# Altium schematic sheet stm_btn.SchDoc
size 420 x 297 mm; Organization: Altium Limited; Address1: L3, 12a Rodborough Rd; Address2: Frenchs Forest; Address3: NSW; Address4: Australia 2086
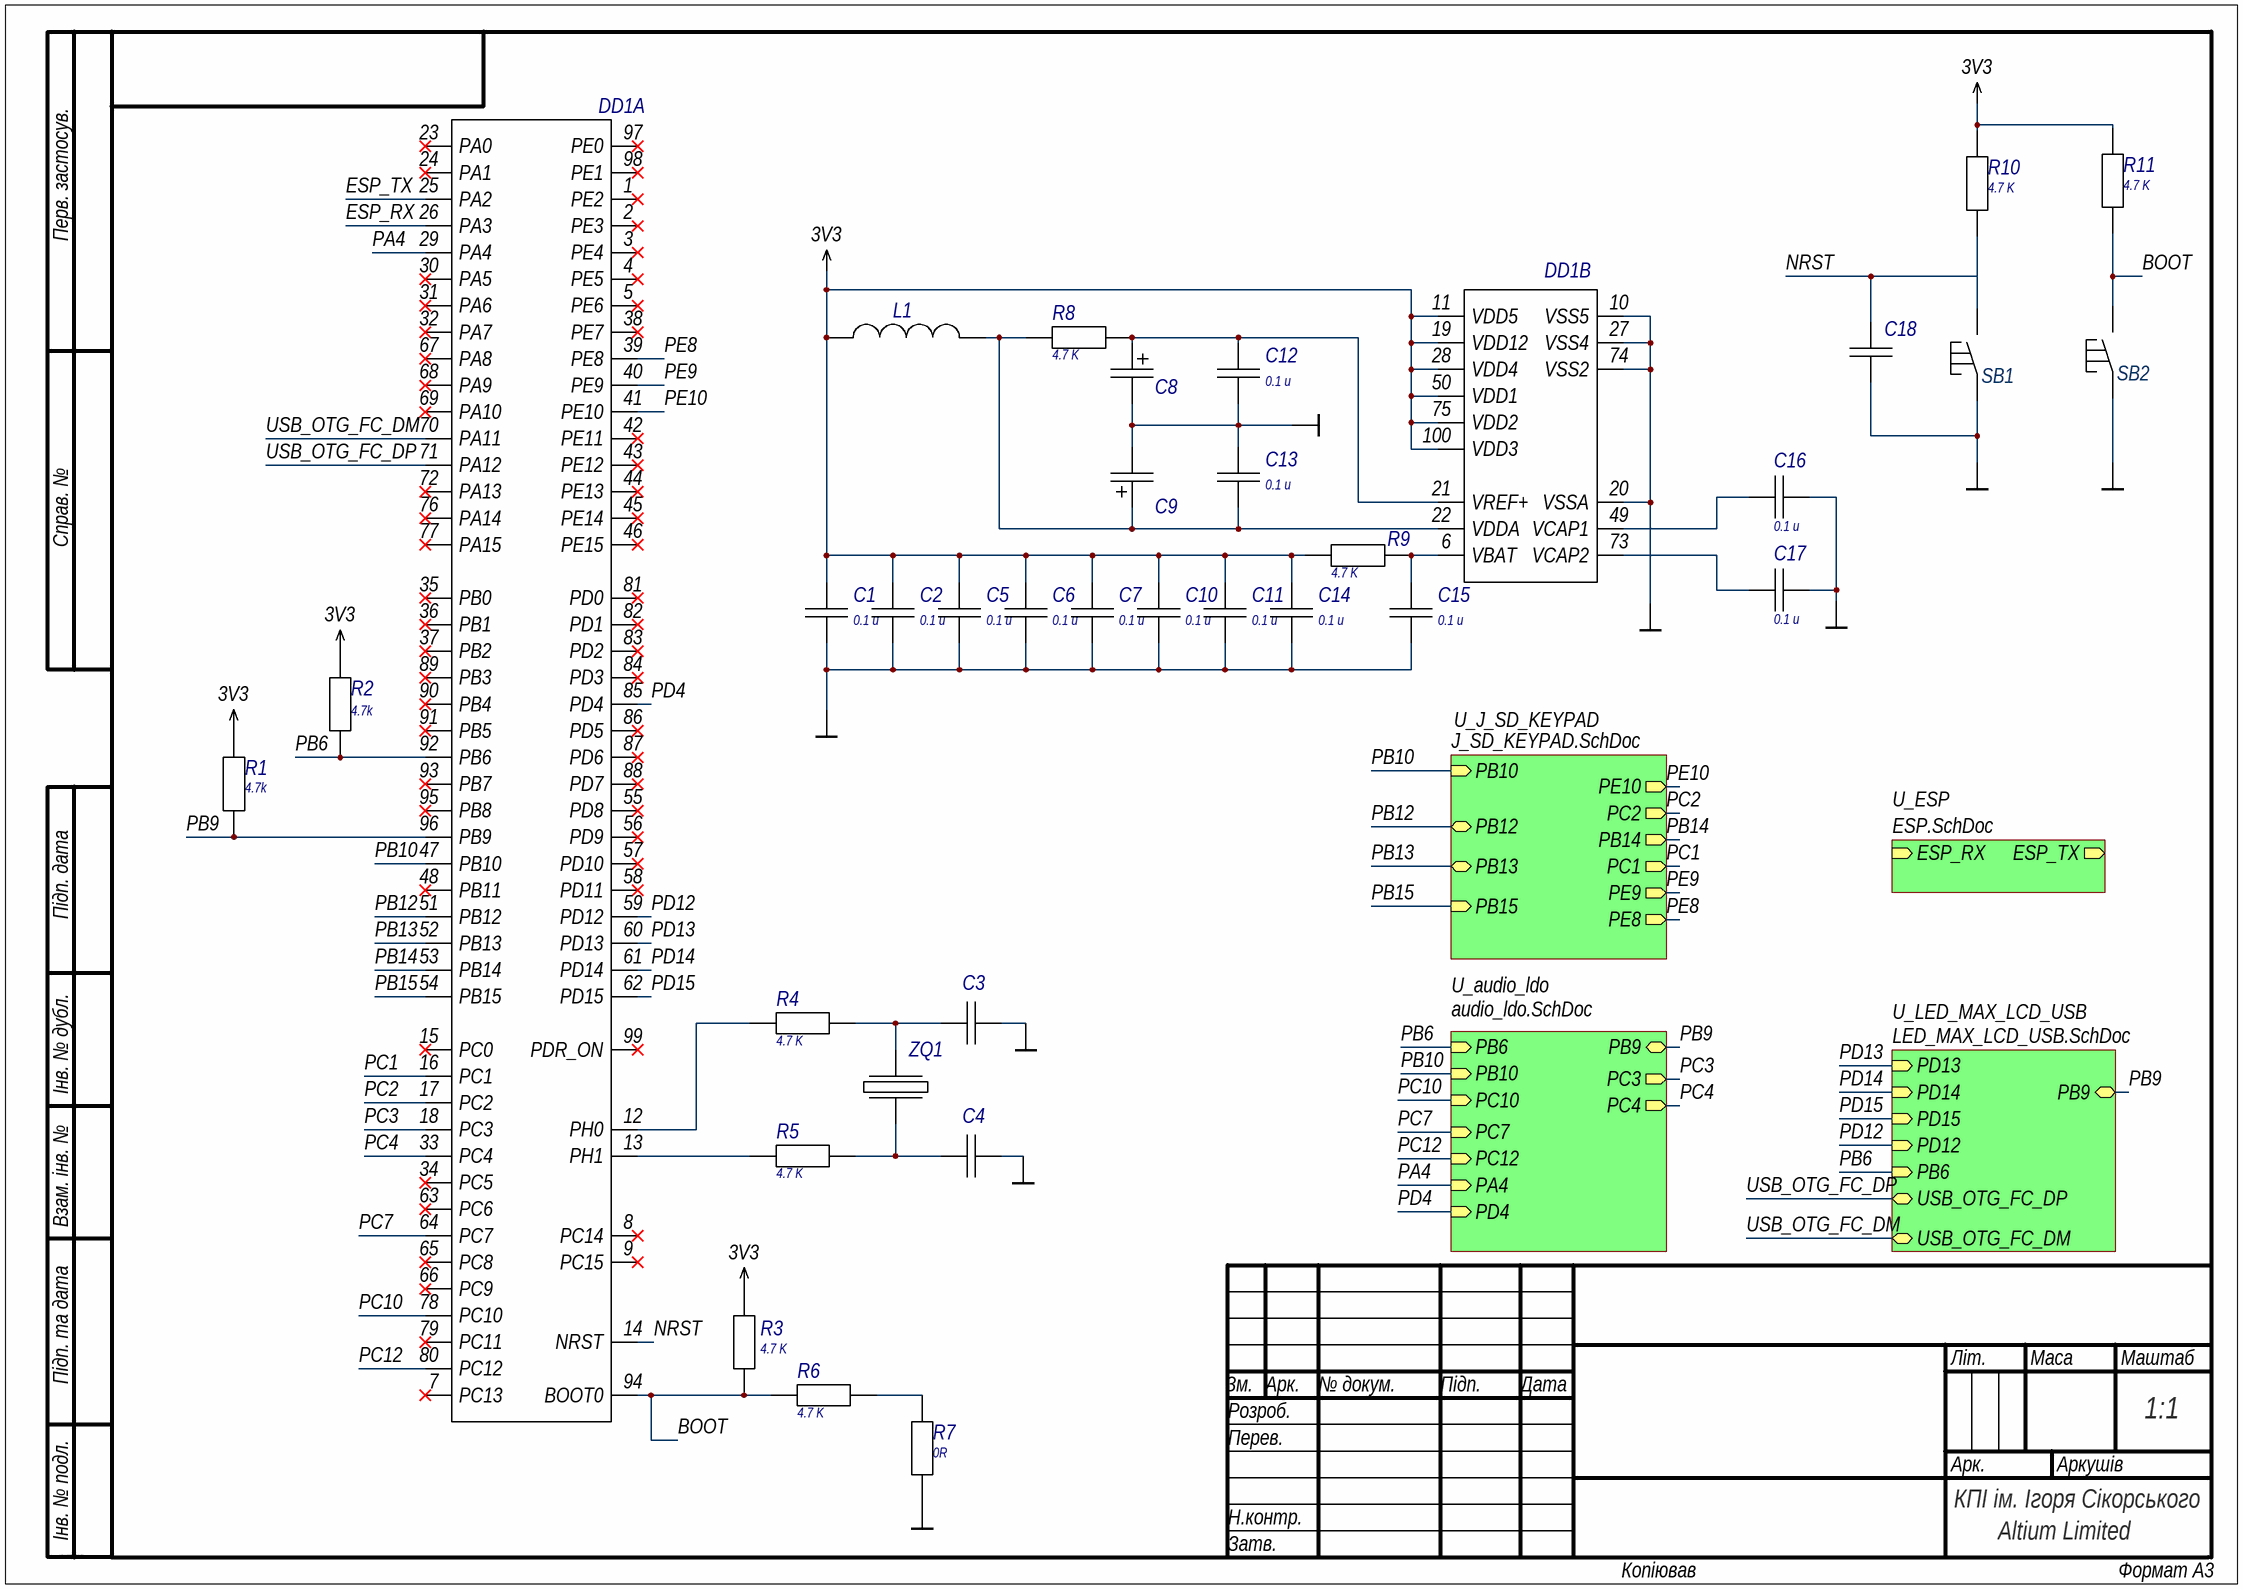
[diagram p0: stm_btn.SchDoc]

## Parts
C1  value 0.1 u  [C_0603]
C2  value 0.1 u  [C_0603]
C3  (no value)  [C_0603]
C4  (no value)  [C_0603]
C5  value 0.1 u  [C_0603]
C6  value 0.1 u  [C_0603]
C7  value 0.1 u  [C_0603]
C8  (no value)  [C_tantal]
C9  (no value)  [C_tantal]
C10  value 0.1 u  [C_0603]
C11  value 0.1 u  [C_0603]
C12  value 0.1 u  [C_0603]
C13  value 0.1 u  [C_0603]
C14  value 0.1 u  [C_0603]
C15  value 0.1 u  [C_0603]
C16  value 0.1 u  [C_0603]
C17  value 0.1 u  [C_0603]
C18  (no value)  [C_0201]
DD1  (no value)  [STM32F407VGT6]  (parts A,B of 2)
L1  (no value)  [INDUCTION]
R1  value 4.7k  [R0_0603]  (hidden comment: 0603 0 В 4.7k 1% Keystone Electronics)
R2  value 4.7k  [R0_0603]  (hidden comment: 0603 0 В 4.7k 1% Keystone Electronics)
R3  value 4.7 K  [R0_0603]  (hidden comment: 0603 В 4.7 K 1% Keystone Electronics)
R4  value 4.7 K  [R0_0603]  (hidden comment: 0603 В 4.7 K 1% Keystone Electronics)
R5  value 4.7 K  [R0_0603]  (hidden comment: 0603 В 4.7 K 1% Keystone Electronics)
R6  value 4.7 K  [R0_0603]  (hidden comment: 0603 В 4.7 K 1% Keystone Electronics)
R7  value 0R  [R0_0603]  (hidden comment: 0603 В 0R 1% Keystone Electronics)
R8  value 4.7 K  [R0_0603]  (hidden comment: 0603 В 4.7 K 1% Keystone Electronics)
R9  value 4.7 K  [R0_0603]  (hidden comment: 0603 В 4.7 K 1% Keystone Electronics)
R10  value 4.7 K  [R0_0603]  (hidden comment: 0603 В 4.7 K 1% Keystone Electronics)
R11  value 4.7 K  [R0_0603]  (hidden comment: 0603 В 4.7 K 1% Keystone Electronics)
SB1  (no value)  [button2]
SB2  (no value)  [button2]
ZQ1  (no value)  [Oscillator]

## Sub-sheets
U_audio_ldo = audio_ldo.SchDoc: PB6 (in), PB10 (in), PB9 (bidir), PC7 (in), PC10 (in), PC12 (in), PD4 (in), PC3 (out), PA4 (in), PC4 (out)
U_ESP = ESP.SchDoc: ESP_RX (in), ESP_TX (out)
U_J_SD_KEYPAD = J_SD_KEYPAD.SchDoc: PE10 (out), PC2 (out), PC1 (out), PB10 (in), PB14 (out), PB12 (bidir), PE9 (out), PE8 (out), PB15 (in), PB13 (bidir)
U_LED_MAX_LCD_USB = LED_MAX_LCD_USB.SchDoc: PD13 (in), PD14 (in), PD15 (in), PD12 (in), PB9 (bidir), PB6 (in), USB_OTG_FC_DP (bidir), USB_OTG_FC_DM (bidir)

## Nets
3V3: C1.2 C2.2 C5.2 C6.2 C7.2 C10.2 C11.2 C14.2 DD1.11(VDD5) DD1.19(VDD12) DD1.28(VDD4) DD1.50(VDD1) DD1.75(VDD2) DD1.100(VDD3) L1.1 R1.2 R2.2 R3.2 R9.2 R10.2 R11.2
GND: C1.1 C2.1 C3.2 C4.2 C5.1 C6.1 C7.1 C8.2 C9.2 C10.1 C11.1 C12.1 C13.2 C14.1 C15.1 C16.1 C17.1 C18.1 DD1.10(VSS5) DD1.20(VSSA) DD1.27(VSS4) DD1.74(VSS2) R7.2 SB1.1 SB2.1
BOOT: DD1.94(BOOT0) R3.1 R6.2 R11.1 SB2.2
ESP_RX: DD1.26(PA3)
ESP_TX: DD1.25(PA2)
NRST: C18.2 DD1.14(NRST) R10.1 SB1.2
PA4: DD1.29(PA4) ; sheet U_audio_ldo/PA4
PB6: DD1.92(PB6) R2.1 ; sheet U_audio_ldo/PB6, sheet U_LED_MAX_LCD_USB/PB6
PB9: DD1.96(PB9) R1.1 ; sheet U_audio_ldo/PB9, sheet U_LED_MAX_LCD_USB/PB9
PB10: DD1.47(PB10) ; sheet U_audio_ldo/PB10, sheet U_J_SD_KEYPAD/PB10
PB12: DD1.51(PB12) ; sheet U_J_SD_KEYPAD/PB12
PB13: DD1.52(PB13) ; sheet U_J_SD_KEYPAD/PB13
PB14: DD1.53(PB14) ; sheet U_J_SD_KEYPAD/PB14
PB15: DD1.54(PB15) ; sheet U_J_SD_KEYPAD/PB15
PC1: DD1.16(PC1) ; sheet U_J_SD_KEYPAD/PC1
PC2: DD1.17(PC2) ; sheet U_J_SD_KEYPAD/PC2
PC3: DD1.18(PC3) ; sheet U_audio_ldo/PC3
PC4: DD1.33(PC4) ; sheet U_audio_ldo/PC4
PC7: DD1.64(PC7) ; sheet U_audio_ldo/PC7
PC10: DD1.78(PC10) ; sheet U_audio_ldo/PC10
PC12: DD1.80(PC12) ; sheet U_audio_ldo/PC12
PD4: DD1.85(PD4) ; sheet U_audio_ldo/PD4
PD12: DD1.59(PD12) ; sheet U_LED_MAX_LCD_USB/PD12
PD13: DD1.60(PD13) ; sheet U_LED_MAX_LCD_USB/PD13
PD14: DD1.61(PD14) ; sheet U_LED_MAX_LCD_USB/PD14
PD15: DD1.62(PD15) ; sheet U_LED_MAX_LCD_USB/PD15
PE8: DD1.39(PE8) ; sheet U_J_SD_KEYPAD/PE8
PE9: DD1.40(PE9) ; sheet U_J_SD_KEYPAD/PE9
PE10: DD1.41(PE10) ; sheet U_J_SD_KEYPAD/PE10
USB_OTG_FC_DM: DD1.70(PA11) ; sheet U_LED_MAX_LCD_USB/USB_OTG_FC_DM
USB_OTG_FC_DP: DD1.71(PA12) ; sheet U_LED_MAX_LCD_USB/USB_OTG_FC_DP
NetC3_1: C3.1 R4.1 ZQ1.2
NetC4_1: C4.1 R5.1 ZQ1.1
NetC8_1: C8.1 C12.2 DD1.21(VREF+) R8.1
NetC9_1: C9.1 C13.1 DD1.22(VDDA) L1.2 R8.2
NetC15_2: C15.2 DD1.6(VBAT) R9.1
NetC16_2: C16.2 DD1.49(VCAP1)
NetC17_2: C17.2 DD1.73(VCAP2)
NetDD1_12: DD1.12(PH0) R4.2
NetDD1_13: DD1.13(PH1) R5.2
NetR6_1: R6.1 R7.1

Not connected (* = marked no-connect by the designer): DD1 1(PE2)* 2(PE3)* 3(PE4)* 4(PE5)* 5(PE6)* 7(PC13)* 8(PC14)* 9(PC15)* 15(PC0)* 23(PA0)* 24(PA1)* 30(PA5)* 31(PA6)* 32(PA7)* 34(PC5)* 35(PB0)* 36(PB1)* 37(PB2)* 38(PE7)* 42(PE11)* 43(PE12)* 44(PE13)* 45(PE14)* 46(PE15)* 48(PB11)* 55(PD8)* 56(PD9)* 57(PD10)* 58(PD11)* 63(PC6)* 65(PC8)* 66(PC9)* 67(PA8)* 68(PA9)* 69(PA10)* 72(PA13)* 76(PA14)* 77(PA15)* 79(PC11)* 81(PD0)* 82(PD1)* 83(PD2)* 84(PD3)* 86(PD5)* 87(PD6)* 88(PD7)* 89(PB3)* 90(PB4)* 91(PB5)* 93(PB7)* 95(PB8)* 97(PE0)* 98(PE1)* 99(PDR_ON)*

## Notes on the sheet
- Перв. застосув.
- Справ. №
- Підп. дата
- Інв. № дубл.
- Взам. інв. №
- Підп. та дата
- Зм.
- Розроб.
- Арк.
- № докум.
- Підп.
- Дата
- Літ.
- Маса
- Маштаб
- 1:1
- Перев.
- Аркушів
- Інв. № подл.
- Н.контр.
- Затв.
- КПІ ім. Ігоря Сікорського
- ALTIUM GOSTBOM2.0 KEV
- Копіював
- Формат А3

## Library data of the parts
C1 C2 C5-C7 C10-C17 = C_0603: Manufacturer: TDK Corporation; Temp_Coef: X7R; Voltage: 50 В; Tolerance: 10%; Package: 0603
C3 C4 = С-20p: Manufacturer: KEMET; Temp_Coef: C0G, NP0; Voltage: 250 В; Tolerance: 0.1%; Value: 20 пкФ; Package: 0603
C8 C9 = С-1u_tantal: Manufacturer: KEMET; Voltage: 20 В; Tolerance: 10%; Value: 1 мкФ; Temp_Coef: -; Package: 1206
C18 = С-0.1u: Manufacturer: Murata Electronics; Temp_Coef: X7R; Voltage: 16 В; Tolerance: 10%; Value: 0.1 мкФ; Package: 0201
DD1 = STM32F407VGT6: Manufacturer: STMicroelectronics; Name: STM32F407VGT6
L1 = induction: Manufacturer: TAI-TECH Advanced Electronics Co., Ltd.; Name: FCM 1608KF-601T03
R1 R2 = R_0603: Power: 0 В; Package: 0603; Tolerance: 1%; Manufacturer: Keystone Electronics
R3-R11 = R_0603: Package: 0603; Power: В; Tolerance: 1%; Manufacturer: Keystone Electronics
SB1 SB2 = button2: Manufacturer: Würth Elektronik; Name: 430182043816
ZQ1 = Oscillator: Manufacturer: ECS Inc.; Name: ECS-2520MV-080-CN-TR